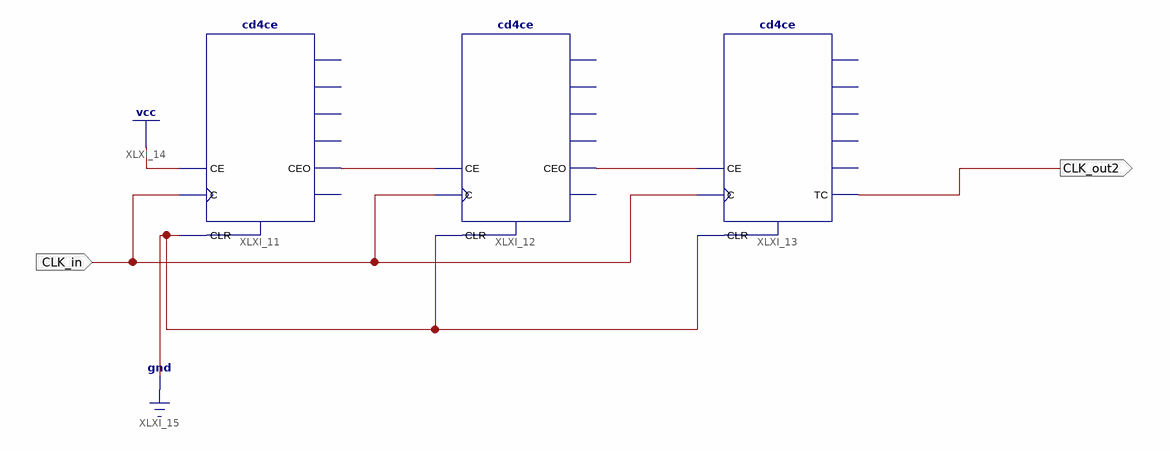
[diagram p0: schematic sheet 1]
// Xilinx ISE schematic Div1k.sch (spartan6) as structural Verilog: 3 symbols, 2 ports
module Div1k (
  input  CLK_in,
  output CLK_out2
);

  wire XLXN_8, XLXN_9;

  cd4ce XLXI_11 (.C(CLK_in), .CE(1'b1), .CLR(1'b0), .CEO(XLXN_9));  // open: Q0, Q1, Q2, Q3, TC
  cd4ce XLXI_12 (.C(CLK_in), .CE(XLXN_9), .CLR(1'b0), .CEO(XLXN_8));  // open: Q0, Q1, Q2, Q3, TC
  cd4ce XLXI_13 (.C(CLK_in), .CE(XLXN_8), .CLR(1'b0), .TC(CLK_out2));  // open: CEO, Q0, Q1, Q2, Q3
endmodule
